# Altium schematic sheet ArbPwrBoost_P5.SchDoc: =ProjectTitle
size B; Engineer: Hab Collector; Organization: Altium Limited; Address1: 3621 Gin Way; Address2: Snellville, GA 30039; SheetNumber: 5; SheetTotal: 8
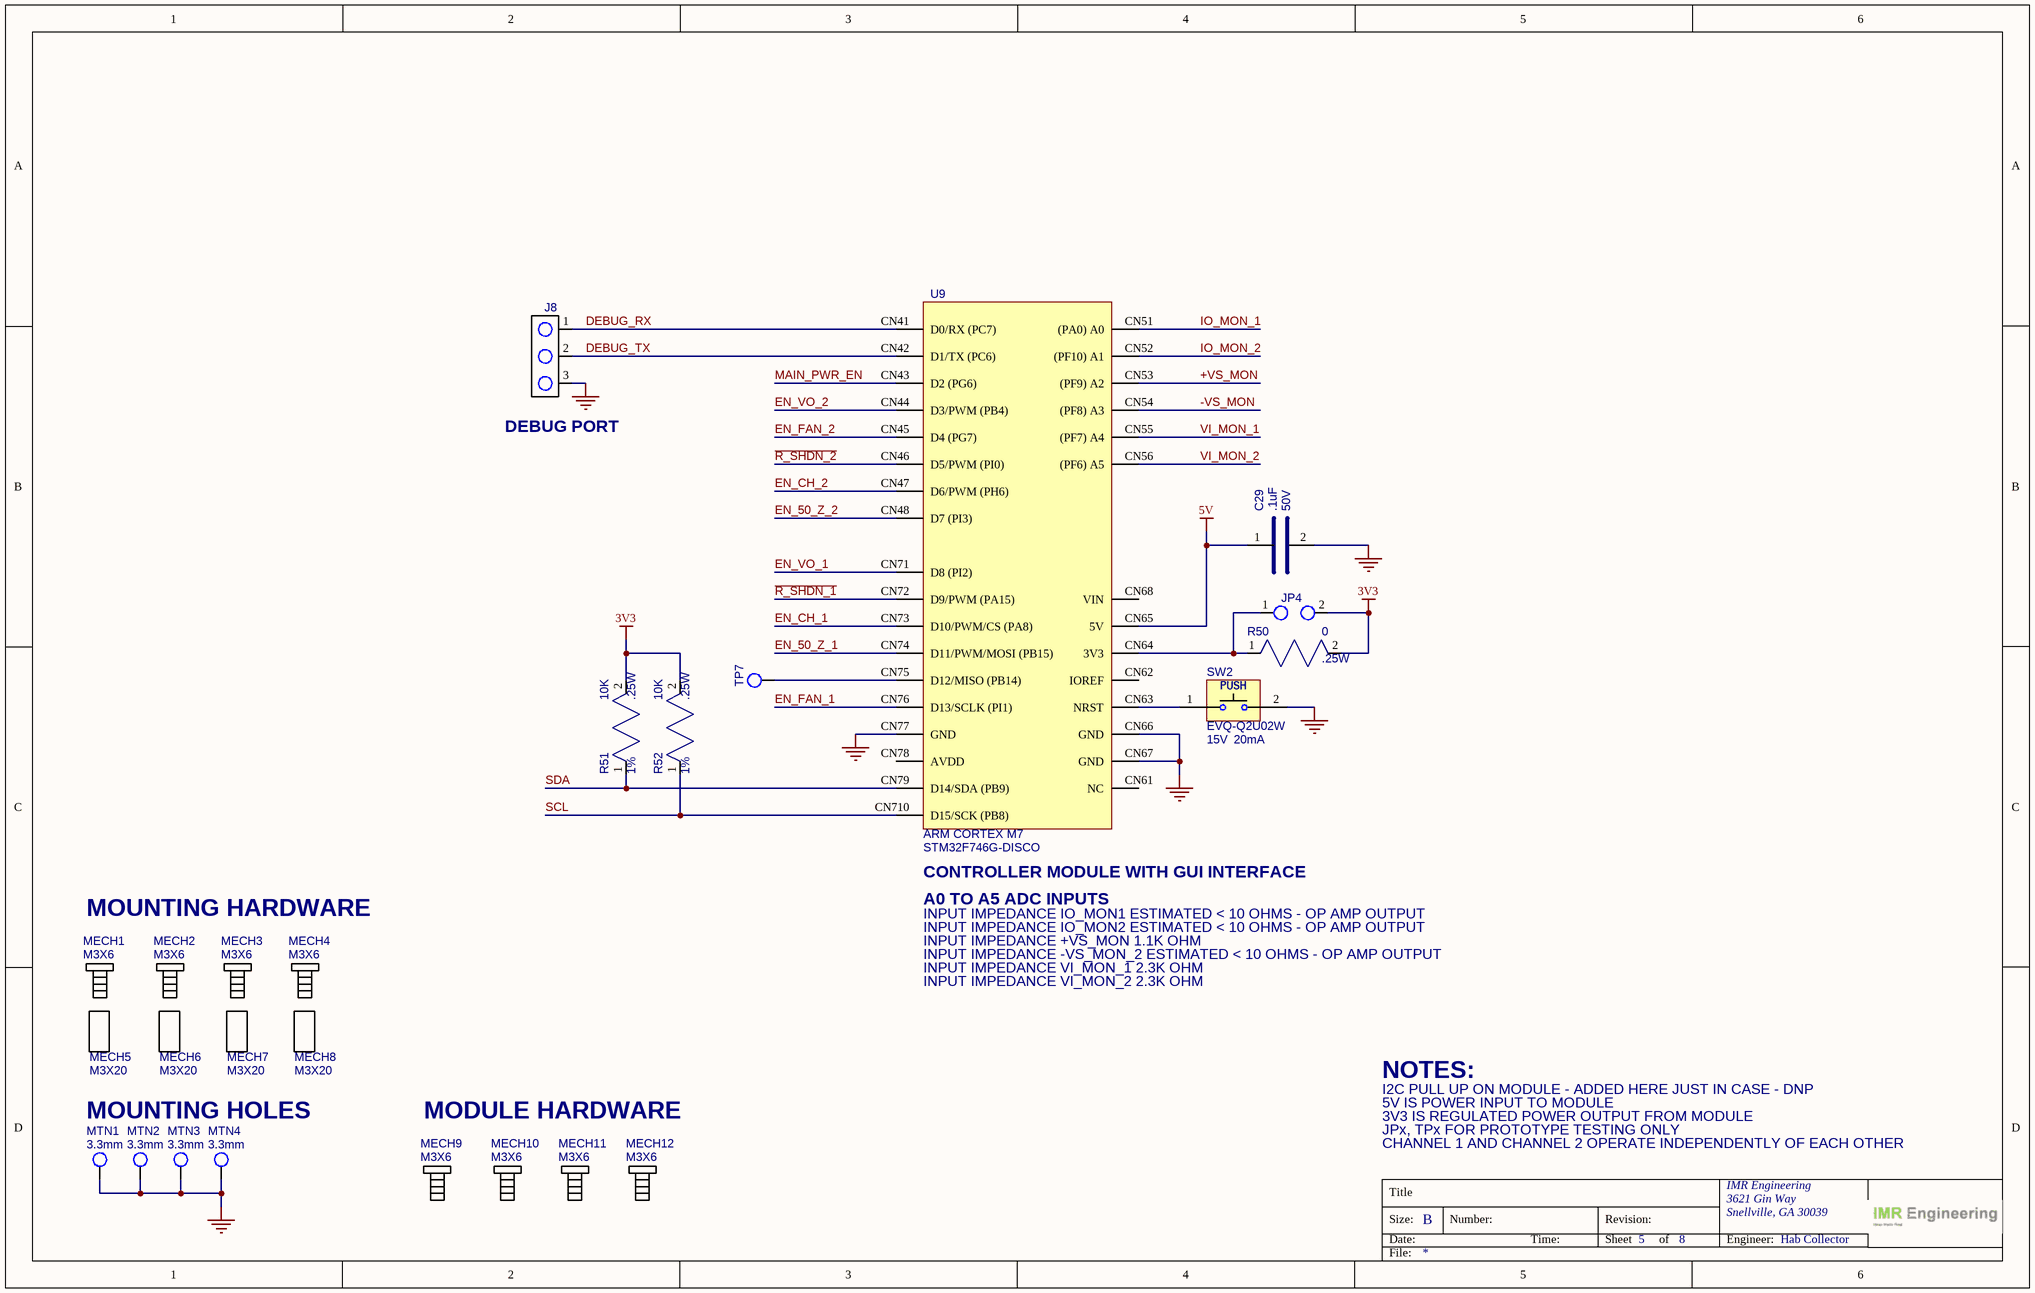
[diagram p0: ArbPwrBoost_P5.SchDoc]

## Parts
C29  value .1uF  Voltage: 50V  [CAP_0805]  (hidden comment: KGM21NR71H104KT)
J8  PREC003SFAN-RC  [HDR_1X3_100MILL]  (value not drawn)
JP4  PREC002SFAN-RC  [HDR_1X2_100MILL]  (value not drawn)
MECH1  Size: M3X6  [MECHANICAL_SCREW_M3X6]  (hidden comment: RM3X6MM 2701)
MECH2  Size: M3X6  [MECHANICAL_SCREW_M3X6]  (hidden comment: RM3X6MM 2701)
MECH3  Size: M3X6  [MECHANICAL_SCREW_M3X6]  (hidden comment: RM3X6MM 2701)
MECH4  Size: M3X6  [MECHANICAL_SCREW_M3X6]  (hidden comment: RM3X6MM 2701)
MECH5  Size: M3X20  [MECHANICAL_SPACER_F_F_M3X20]  (hidden comment: 24407)
MECH6  Size: M3X20  [MECHANICAL_SPACER_F_F_M3X20]  (hidden comment: 24407)
MECH7  Size: M3X20  [MECHANICAL_SPACER_F_F_M3X20]  (hidden comment: 24407)
MECH8  Size: M3X20  [MECHANICAL_SPACER_F_F_M3X20]  (hidden comment: 24407)
MECH9  Size: M3X6  [MECHANICAL_SCREW_M3X6]  (hidden comment: RM3X6MM 2701)
MECH10  Size: M3X6  [MECHANICAL_SCREW_M3X6]  (hidden comment: RM3X6MM 2701)
MECH11  Size: M3X6  [MECHANICAL_SCREW_M3X6]  (hidden comment: RM3X6MM 2701)
MECH12  Size: M3X6  [MECHANICAL_SCREW_M3X6]  (hidden comment: RM3X6MM 2701)
MTN1  Hole Size: 3.3mm  [PMG_MT_HOLE_3.3MM]  (no BOM)
MTN2  Hole Size: 3.3mm  [PMG_MT_HOLE_3.3MM]  (no BOM)
MTN3  Hole Size: 3.3mm  [PMG_MT_HOLE_3.3MM]  (no BOM)
MTN4  Hole Size: 3.3mm  [PMG_MT_HOLE_3.3MM]  (no BOM)
R50  value 0  Power: .25W  [RES_0805]  (hidden comment: RC0805JR-070RL)
R51  value 10K  Power: .25W  Tolerance: 1%  [RES_0805]  (hidden comment: RC0805FR-7W10KL)
R52  value 10K  Power: .25W  Tolerance: 1%  [RES_0805]  (hidden comment: RC0805FR-7W10KL)
SW2  value 15V  Current: 20mA  [PANASONIC_EVQ-Q2U02W]  (hidden comment: EVQ-Q2U02W)
TP7  (no value)  [TEST_POINT_20MIL_TH]  (no BOM)
U9  value ARM CORTEX M7  [STM32F746G-DISCO]  (hidden comment: STM32F746G-DISCO)

## Nets
3V3: JP4.2 R50.2 R51.2 R52.2
5V: C29.1 U9.CN65(5V)
GND: C29.2 J8.3 MTN1.1 MTN2.1 MTN3.1 MTN4.1 SW2.2(B') U9.CN66(GND) U9.CN67(GND) U9.CN77(GND)
+VS_MON: U9.CN53((PF9)_A2)
-VS_MON: U9.CN54((PF8)_A3)
~{R_SHDN_1}: U9.CN72(D9/PWM_(PA15))
~{R_SHDN_2}: U9.CN46(D5/PWM_(PI0))
DEBUG_RX: J8.1 U9.CN41(D0/RX_(PC7))
DEBUG_TX: J8.2 U9.CN42(D1/TX_(PC6))
EN_50_Z_1: U9.CN74(D11/PWM/MOSI_(PB15))
EN_50_Z_2: U9.CN48(D7_(PI3))
EN_CH_1: U9.CN73(D10/PWM/CS_(PA8))
EN_CH_2: U9.CN47(D6/PWM_(PH6))
EN_FAN_1: U9.CN76(D13/SCLK_(PI1))
EN_FAN_2: U9.CN45(D4_(PG7))
EN_VO_1: U9.CN71(D8_(PI2))
EN_VO_2: U9.CN44(D3/PWM_(PB4))
IO_MON_1: U9.CN51((PA0)_A0)
IO_MON_2: U9.CN52((PF10)_A1)
MAIN_PWR_EN: U9.CN43(D2_(PG6))
SCL: R52.1 U9.CN710(D15/SCK_(PB8))
SDA: R51.1 U9.CN79(D14/SDA_(PB9))
VI_MON_1: U9.CN55((PF7)_A4)
VI_MON_2: U9.CN56((PF6)_A5)
NetJP4_1: JP4.1 R50.1 U9.CN64(3V3)
NetSW2_1: SW2.1(B) U9.CN63(NRST)
NetTP7_1: TP7.1 U9.CN75(D12/MISO_(PB14))

Not connected (* = marked no-connect by the designer): U9 CN61(NC) CN62(IOREF) CN68(VIN) CN78(AVDD)

## Notes on the sheet
- (near J8) DEBUG PORT
- (near U9) CONTROLLER MODULE WITH GUI INTERFACE
- A0 TO A5 ADC INPUTS
- MOUNTING HARDWARE
- INPUT IMPEDANCE IO_MON1 ESTIMATED < 10 OHMS - OP AMP OUTPUT
- INPUT IMPEDANCE IO_MON2 ESTIMATED < 10 OHMS - OP AMP OUTPUT
- INPUT IMPEDANCE +VS_MON 1.1K OHM
- INPUT IMPEDANCE -VS_MON_2 ESTIMATED < 10 OHMS - OP AMP OUTPUT
- INPUT IMPEDANCE VI_MON_1 2.3K OHM
- INPUT IMPEDANCE VI_MON_2 2.3K OHM
- I2C PULL UP ON MODULE - ADDED HERE JUST IN CASE - DNP
- NOTES:
- 5V IS POWER INPUT TO MODULE
- MOUNTING HOLES
- MODULE HARDWARE
- 3V3 IS REGULATED POWER OUTPUT FROM MODULE
- CHANNEL 1 AND CHANNEL 2 OPERATE INDEPENDENTLY OF EACH OTHER
- JPx, TPx FOR PROTOTYPE TESTING ONLY
- Title
- Size:
- Date:
- B
- Number:
- Time:
- Revision:
- Sheet
- of
- IMR Engineering
- Engineer:
- File:
- (in symbol SWITCH_EVQ-Q2U02W) PUSH

## Library data of the parts
C29 = CAP_SMD_0.1UF_50V_0805: CAP CER 0.1UF 50V X7R 0805; MFG: KYOCERA AVX; Case/Package: 0805; MFG_PN: KGM21NR71H104KT; Supplier 1: DigiKey; Supplier Part Number 1: 478-KGM21NR71H104KTCT-ND; Unit Price: .1
J8 = CONN_HEADER_3P_100MIL_VERT: CONN HEADER VERT 3POS 2.54MM; MFG: Sullins Connector Solutions; Case/Package: 2P_2.54MM; MFG_PN: PREC003SFAN-RC; Supplier 1: Digi-Key; Supplier Part Number 1: S1212EC-03-ND; Value: *; Unit Price: .07
JP4 = CONN_JUMPER_2P_100MIL_VERT: CONN HEADER VERT 2POS 2.54MM; MFG: Sullins Connector Solutions; Case/Package: 2P_2.54MM; MFG_PN: PREC002SFAN-RC; Supplier 1: Digi-Key; Supplier Part Number 1: S1212EC-02-ND; Value: *; Unit Price: .07
MECH1-MECH4 MECH9-MECH12 = MECHANICAL_SCREW_M3X6_PAN_HEAD: SCREW M3X6 PAN HEAD SS; MFG: APM Hexseal; Case/Package: SCREW_M3X6; Supplier 1: DigiKey; Supplier Part Number 1: 335-1156-ND; Unit Price: .58; MFG_PN: RM3X6MM 2701
MECH5-MECH8 = MECHANICAL_STANDOFF_M3X20: HEX STANDOFF M3 BRASS 20MM; MFG: Keystone Electronics; Case/Package: STANDOFF_M3X20; Supplier 1: DigiKey; Supplier Part Number 1: 36-24407-ND; Unit Price: 1.36; MFG_PN: 24407
MTN1-MTN4 = MTN_HOLE_3.3MM: MOUNTING HOLE 3.3MM
R50 = RES_SMD_0_0805_1/8W_1%: RES SMD 0 OHM 1% 1/8W 0805; MFG: Yageo; Case/Package: 0805; MFG_PN: RC0805JR-070RL; Supplier 1: DigiKey; Supplier Part Number 1: 311-0.0ARCT-ND; Unit Price: .1; Tolerance: 1%
R51 R52 = RES_SMD_10K_0805_1/4W_1%: RES SMD 10K OHM 1% 1/4W 0805; MFG: Yageo; Case/Package: 0805; MFG_PN: RC0805FR-7W10KL; Supplier 1: DigiKey; Supplier Part Number 1: 13-RC0805FR-7W10KLCT-ND; Unit Price: .10
SW2 = SWITCH_EVQ-Q2U02W: SWITCH TACTILE SPST-NO 0.02A 15V; MFG: American Zettler; Case/Package: EVQQ2; Supplier 1: DigiKey; Supplier Part Number 1: P12954SCT-ND; Unit Price: .25; MFG_PN: EVQ-Q2U02W
TP7 = CONN_TEST_POINT_TH_PAD_20MIL: TEST POINT TH 20MIL HOLE
U9 = MODULE_STM32F746G-DISCO: DISCOVERY STM32 F7 EVAL BRD; MFG: ST Microlectronics; Current: 2A; Case/Package: STM32F746G-DISCO; Supplier 1: DigiKey; Supplier Part Number 1: 497-15680-5-ND; Unit Price: 57.50; MFG_PN: STM32F746G-DISCO